# Altium schematic sheet Sheet1.SchDoc
size A2
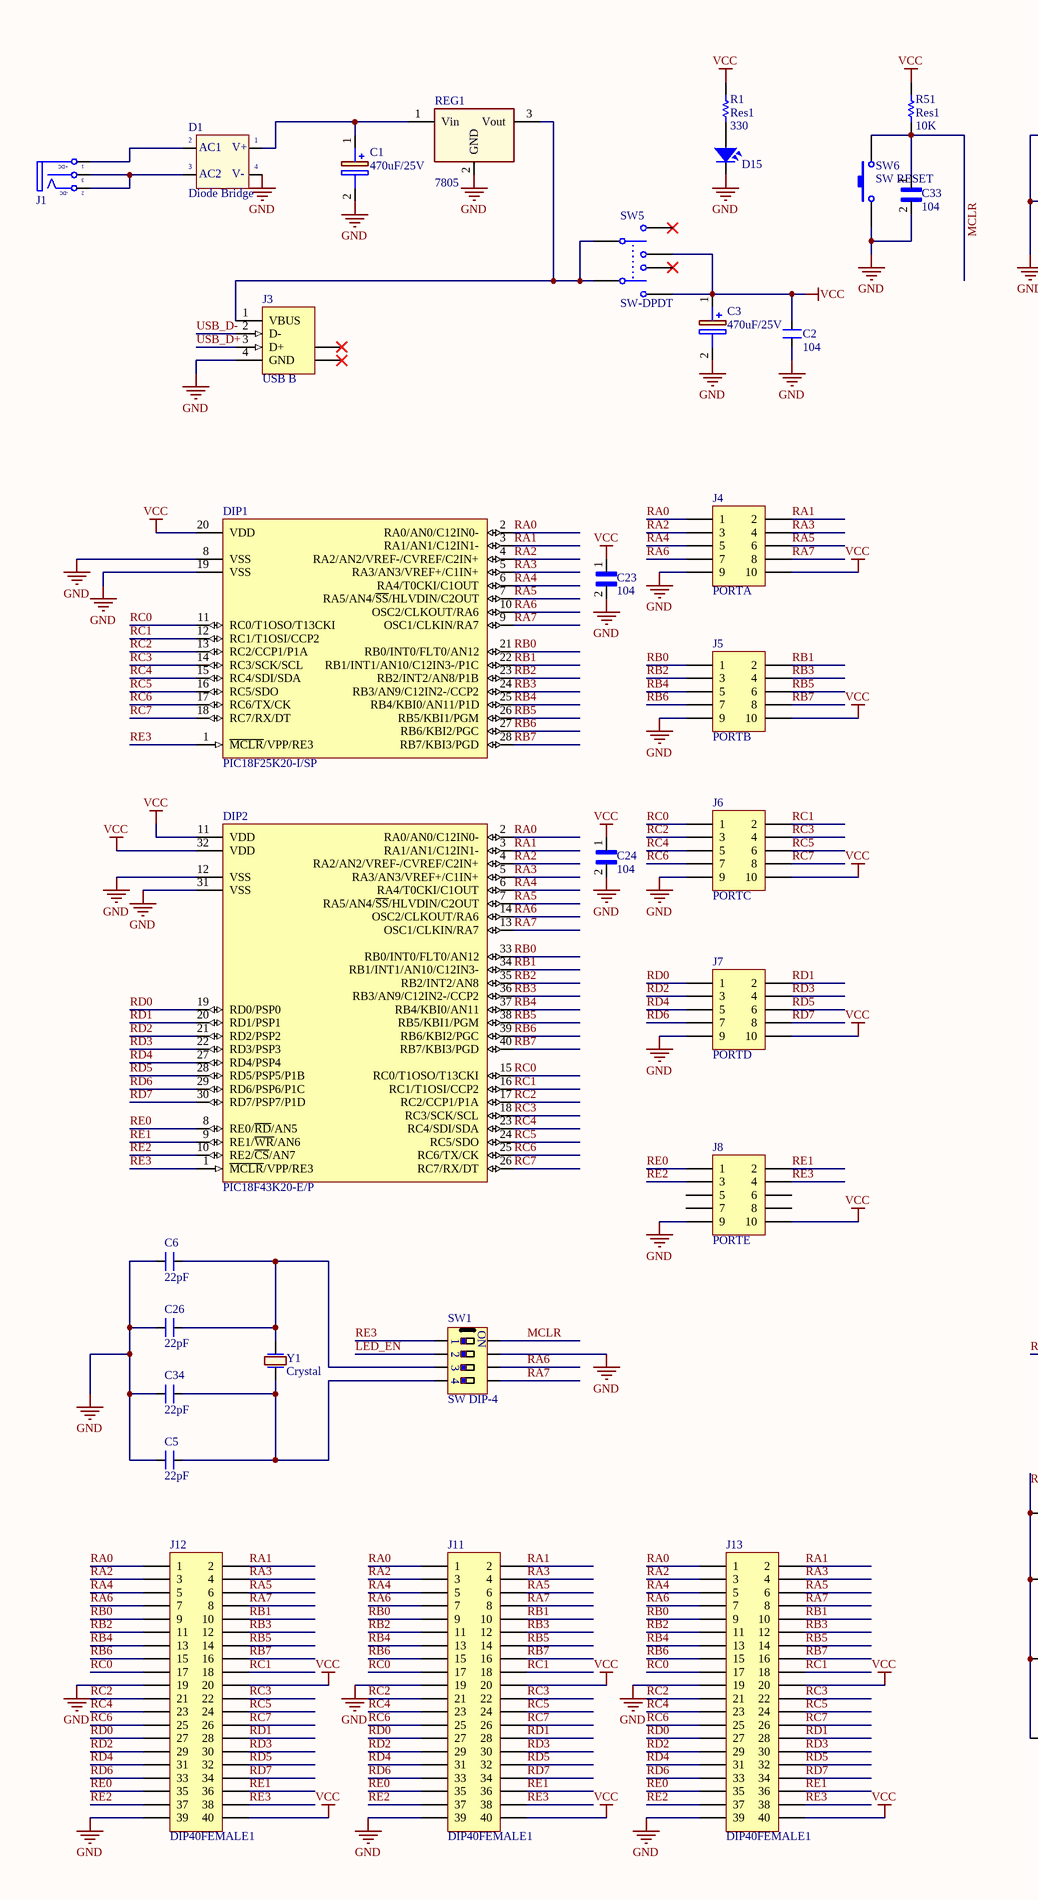
[diagram p0: Sheet1.SchDoc, left]
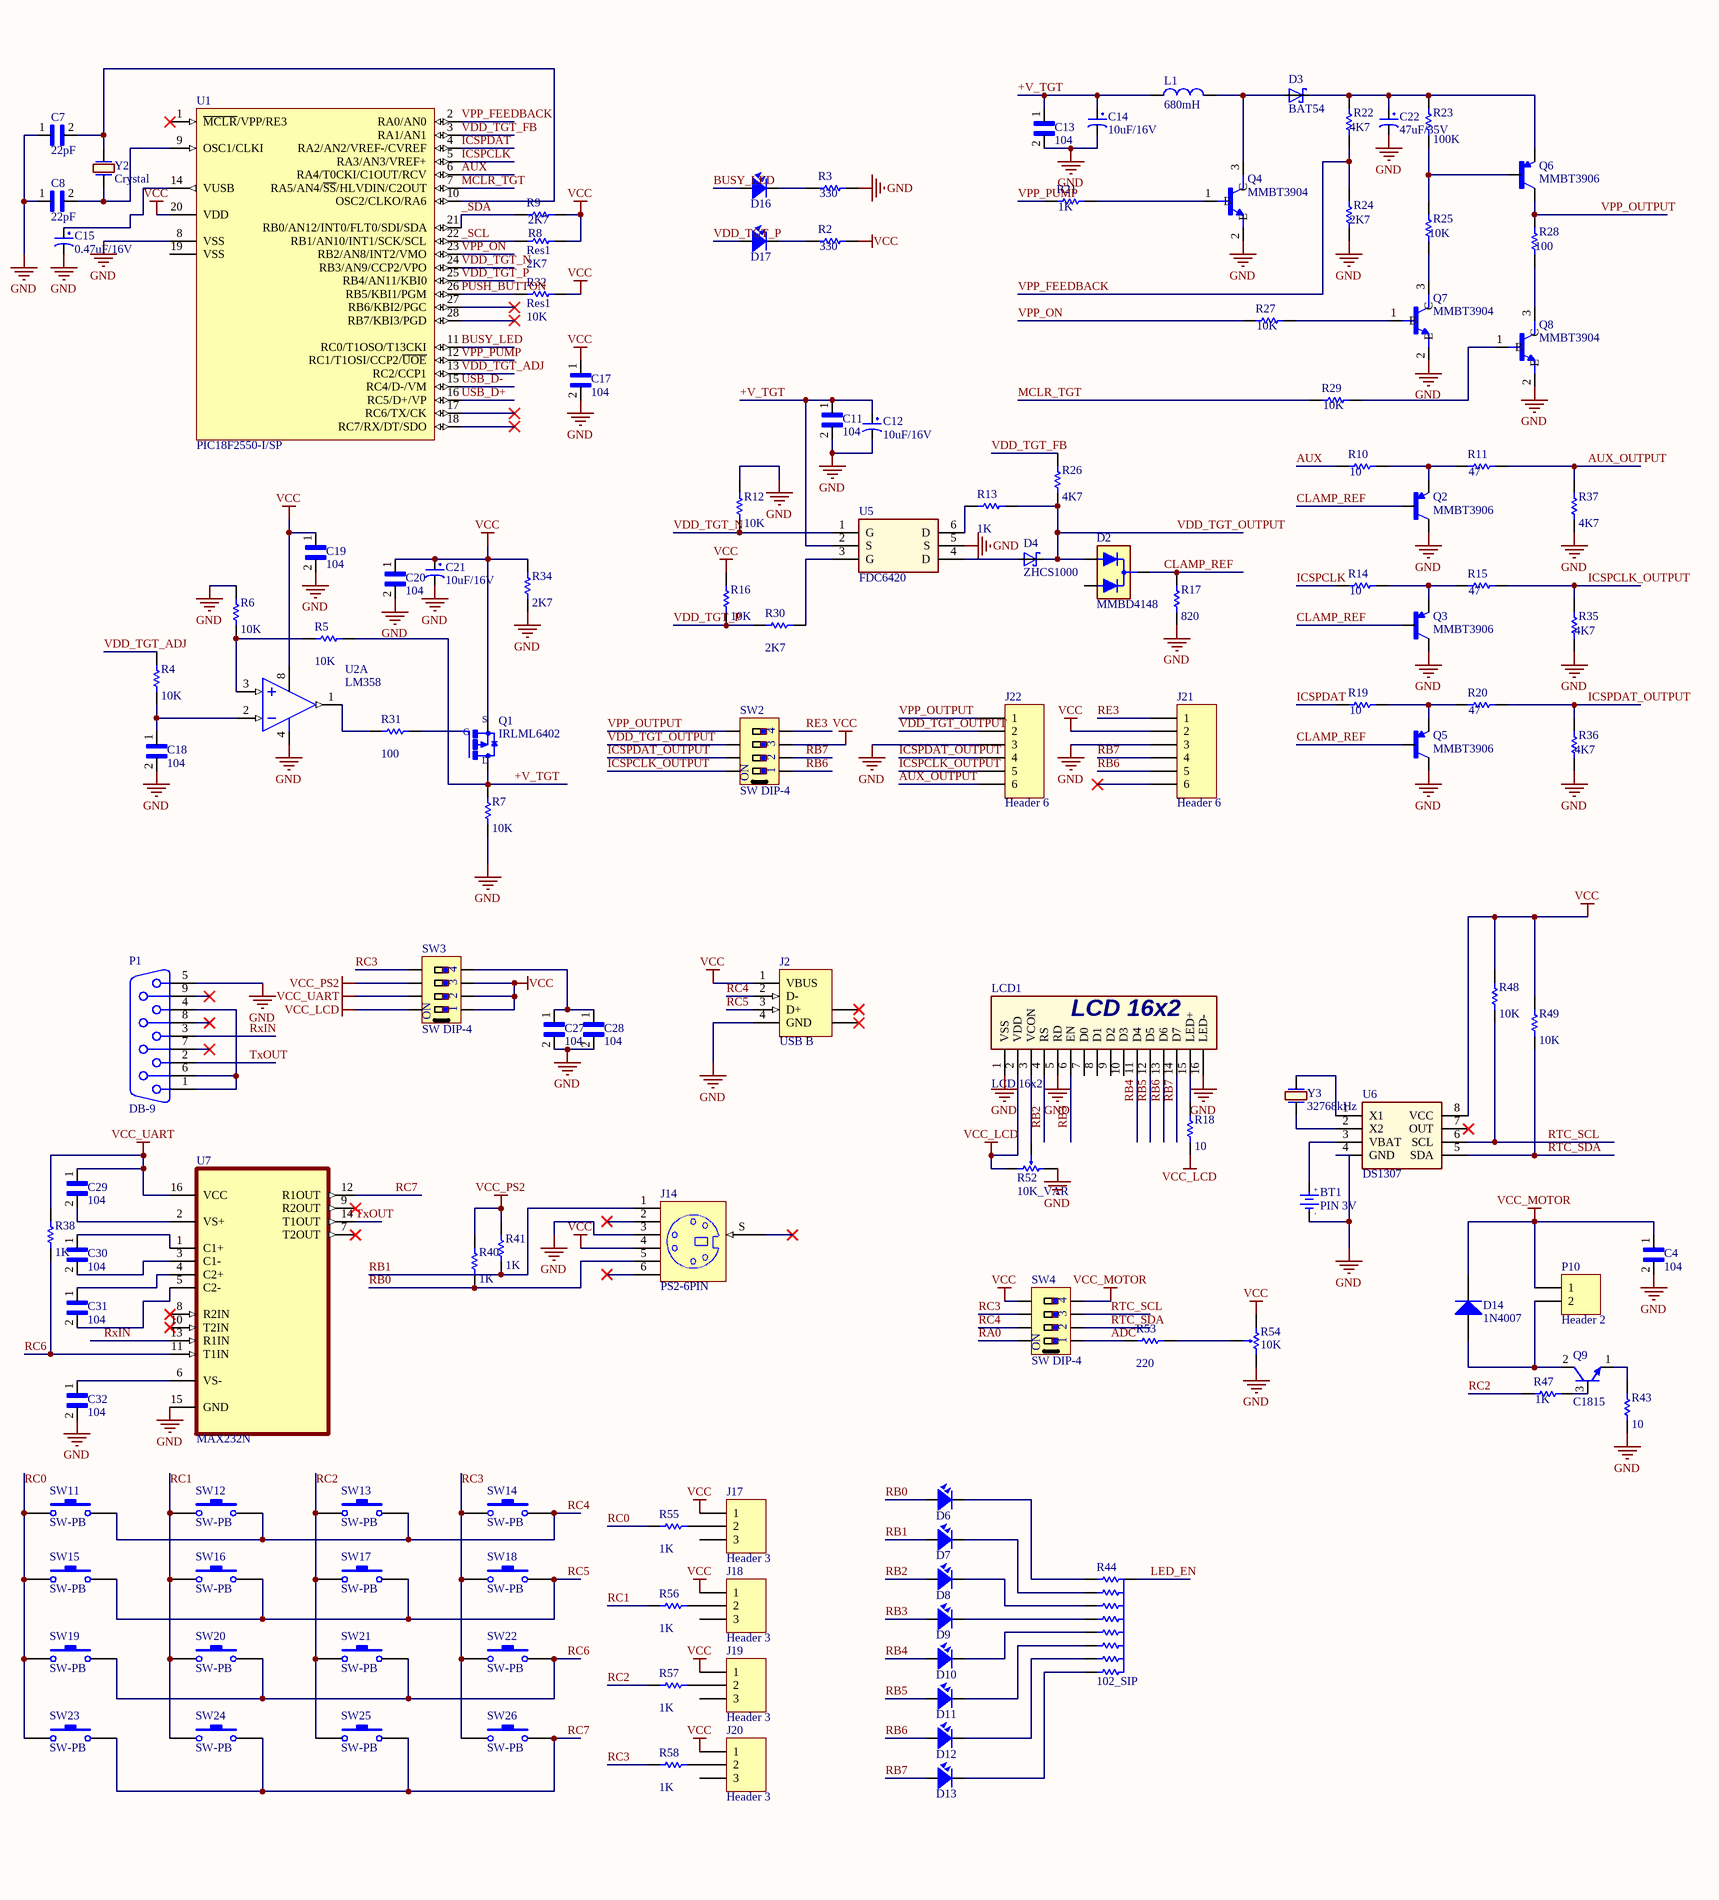
[diagram p1: Sheet1.SchDoc, right]

## Parts
BT1  PIN 3V  [PIN3V]
C1  470uF/25V  [CAPPRD500W60D1000H1400]
C2  104  [CN2]
C3  470uF/25V  [CAPPRD500W60D1000H1400]
C4  104  [CAPC1608X90]
C5  22pF  [CN2]
C6  22pF  [CN2]
C7  22pF  [CAPC1608X90]
C8  22pF  [CAPC1608X90]
C11  104  [CAPC1608X90]
C12  10uF/16V  [CP1/2]
C13  104  [CAPC1608X90]
C14  10uF/16V  [CP1/2]
C15  0.47uF/16V  [CP1/2]
C17  104  [CAPC1608X90]
C18  104  [CAPC1608X90]
C19  104  [CAPC1608X90]
C20  104  [CAPC1608X90]
C21  10uF/16V  [CP1/2]
C22  47uF/35V  [CP1/2]
C23  104  [CAPC1608X90]
C24  104  [CAPC1608X90]
C26  22pF  [CN2]
C27  104  [CAPC1608X90]
C28  104  [CAPC1608X90]
C29  104  [CAPC1608X90]
C30  104  [CAPC1608X90]
C31  104  [CAPC1608X90]
C32  104  [CAPC1608X90]
C33  104  [CAPC1608X90]
C34  22pF  [CN2]
D1  Diode Bridge  [BRIDGE DIODE 2A]
D2  MMBD4148  [SOT23]
D3  BAT54  [SOT23]
D4  ZHCS1000  [SOT-23]
D6  LED  [LED-3]  (value not drawn)
D7  LED  [LED-3]  (value not drawn)
D8  LED  [LED-3]  (value not drawn)
D9  LED  [LED-3]  (value not drawn)
D10  LED  [LED-3]  (value not drawn)
D11  LED  [LED-3]  (value not drawn)
D12  LED  [LED-3]  (value not drawn)
D13  LED  [LED-3]  (value not drawn)
D14  1N4007  [DO-41]
D15  LED  [LED-3]  (value not drawn)
D16  LED  [LED-3]  (value not drawn)
D17  LED  [LED-3]  (value not drawn)
DIP1  PIC18F25K20-I/SP  [SPDIP300-SP28]
DIP2  PIC18F43K20-E/P  [PDIP600-P40]
J1  CON DC PWR  [CON PWR 5MM]  (value not drawn)
J2  USB B  [CON USB B]
J3  USB B  [CON USB B]
J4  PORTA  [HDR2X5]
J5  PORTB  [HDR2X5]
J6  PORTC  [HDR2X5]
J7  PORTD  [HDR2X5]
J8  PORTE  [HDR2X5]
J11  DIP40FEMALE1  [HDR2X20]
J12  DIP40FEMALE1  [HDR2X20]
J13  DIP40FEMALE1  [HDR2X20]
J14  PS2-6PIN  [PS2-6PIN]
J17  Header 3  [HDR1X3]
J18  Header 3  [HDR1X3]
J19  Header 3  [HDR1X3]
J20  Header 3  [HDR1X3]
J21  Header 6  [HDR1X6]
J22  Header 6  [HDR1X6]
L1  680mH  [L/0.4]
LCD1  LCD 16x2  [LCD 16x2]
P1  DB-9  [CON DB9 FEMALE]
P10  Header 2  [HDR1X2]
Q1  IRLML6402  [SOT23]
Q2  MMBT3906  [SOT23-3]
Q3  MMBT3906  [SOT23-3]
Q4  MMBT3904  [SOT95P240X120-3N]
Q5  MMBT3906  [SOT23-3]
Q6  MMBT3906  [SOT23-3]
Q7  MMBT3904  [SOT95P240X120-3N]
Q8  MMBT3904  [SOT95P240X120-3N]
Q9  C1815  [TO-92]
R1  Res1  value 330  [AXIAL-0.3]
R2  value 330  [AXIAL-0.3]
R3  value 330  [AXIAL-0.3]
R4  value 10K  [AXIAL-0.3]
R5  value 10K  [AXIAL-0.3]
R6  value 10K  [AXIAL-0.3]
R7  value 10K  [AXIAL-0.3]
R8  Res1  value 2K7  [AXIAL-0.3]
R9  value 2K7  [AXIAL-0.3]
R10  value 10  [AXIAL-0.3]
R11  value 47  [AXIAL-0.3]
R12  value 10K  [AXIAL-0.3]
R13  value 1K  [AXIAL-0.3]
R14  value 10  [AXIAL-0.3]
R15  value 47  [AXIAL-0.3]
R16  value 10K  [AXIAL-0.3]
R17  value 820  [AXIAL-0.3]
R18  value 10  [AXIAL-0.3]
R19  value 10  [AXIAL-0.3]
R20  value 47  [AXIAL-0.3]
R21  value 1K  [AXIAL-0.3]
R22  value 4K7  [AXIAL-0.3]
R23  value 100K  [AXIAL-0.3]
R24  value 2K7  [AXIAL-0.3]
R25  value 10K  [AXIAL-0.3]
R26  value 4K7  [AXIAL-0.3]
R27  value 10K  [AXIAL-0.3]
R28  value 100  [AXIAL-0.3]
R29  value 10K  [AXIAL-0.3]
R30  value 2K7  [AXIAL-0.3]
R31  value 100  [AXIAL-0.3]
R32  Res1  value 10K  [AXIAL-0.3]
R34  value 2K7  [AXIAL-0.3]
R35  value 4K7  [AXIAL-0.3]
R36  value 4K7  [AXIAL-0.3]
R37  value 4K7  [AXIAL-0.3]
R38  value 1K  [AXIAL-0.3]
R40  value 1K  [AXIAL-0.3]
R41  value 1K  [AXIAL-0.3]
R43  value 10  [AXIAL-0.3]
R44  102_SIP  [R SIP9]
R47  value 1K  [AXIAL-0.3]
R48  value 10K  [AXIAL-0.3]
R49  value 10K  [AXIAL-0.3]
R51  Res1  value 10K  [AXIAL-0.3]
R52  10K_VAR  [R VAR D]
R53  value 220  [AXIAL-0.3]
R54  10K  [R VAR B]
R55  value 1K  [AXIAL-0.3]
R56  value 1K  [AXIAL-0.3]
R57  value 1K  [AXIAL-0.3]
R58  value 1K  [AXIAL-0.3]
REG1  7805  [TO-220]
SW1  SW DIP-4  [SW/DIP4]
SW2  SW DIP-4  [SW/DIP4]
SW3  SW DIP-4  [SW/DIP4]
SW4  SW DIP-4  [SW/DIP4]
SW5  SW-DPDT  [DPDT-6]
SW6  SW RESET  [SPST-2]
SW11  SW-PB  [SPST-2]
SW12  SW-PB  [SPST-2]
SW13  SW-PB  [SPST-2]
SW14  SW-PB  [SPST-2]
SW15  SW-PB  [SPST-2]
SW16  SW-PB  [SPST-2]
SW17  SW-PB  [SPST-2]
SW18  SW-PB  [SPST-2]
SW19  SW-PB  [SPST-2]
SW20  SW-PB  [SPST-2]
SW21  SW-PB  [SPST-2]
SW22  SW-PB  [SPST-2]
SW23  SW-PB  [SPST-2]
SW24  SW-PB  [SPST-2]
SW25  SW-PB  [SPST-2]
SW26  SW-PB  [SPST-2]
U1  PIC18F2550-I/SP  [SPDIP300-SP28]
U2  LM358  [DIP8/W0.3]  (part A of 2)
U5  FDC6420  [SOT-6]
U6  DS1307  [DIP 8]
U7  MAX232N  [DIP254P762X508-16]
Y1  Crystal  [Crystal HC49S DIP]
Y2  Crystal  [Crystal HC49S DIP]
Y3  32768kHz  [Crystal DIP-2]

## Nets
GND: BT1.2(GND) C1.2(-) C2.2 C3.2(-) C4.2 C5.1 C6.1 C7.1 C8.1 C11.2 C12.2 C13.2 C14.2 C15.2 C17.2 C18.2 C19.2 C20.2 C21.2 C22.2 C23.2 C24.2 C26.1 C27.2 C28.2 C32.2 C33.2 C34.1 D1.4(-V_OUT) D15.2 DIP1.8(VSS) DIP1.19(VSS) DIP2.12(VSS) DIP2.31(VSS) J2.4(GND) J3.4(GND) J4.9 J5.9 J6.9 J7.9 J8.9 J11.19 J11.39 J12.19 J12.39 J13.19 J13.39 J14.3 J21.3 J22.3 LCD1.1(VSS) LCD1.5(RD) LCD1.16(LED-) P1.5 Q2.3(C) Q3.3(C) Q4.2(E) Q5.3(C) Q7.2(E) Q8.2(E) R3.2 R6.2 R7.1 R12.2 R17.1 R24.1 R34.1 R35.1 R36.1 R37.1 R43.1 R52.3 R54.1 REG1.2(GND) SW1.7 SW6.1 U1.8(VSS) U2.4(-V) U5.5(S) U6.4(GND) U7.15(GND)
VCC: C2.1 C3.1(+) C17.1 C19.1 C20.1 C21.1 C23.1 C24.1 DIP1.20(VDD) DIP2.11(VDD) DIP2.32(VDD) J2.1(VBUS) J4.10 J5.10 J6.10 J7.10 J8.10 J11.20 J11.40 J12.20 J12.40 J13.20 J13.40 J14.4 J17.1 J18.1 J19.1 J20.1 J21.2 Q1.2(S) R1.2 R2.2 R8.2 R9.2 R16.2 R32.2 R34.2 R48.2 R49.2 R51.2 R54.3 SW2.3 SW3.1 SW3.2 SW3.3 SW4.5 SW5.3 SW5.6 U1.20(VDD) U2.8(+V) U6.8(VCC)
VCC_LCD: LCD1.2(VDD) R18.1 R52.1 SW3.8
VCC_MOTOR: C4.1 D14.2(K) P10.1 SW4.4
VCC_PS2: R40.2 R41.2 SW3.6
VCC_UART: C29.1 R38.2 SW3.7 U7.16(VCC)
+V_TGT: C11.1 C12.1 C13.1 C14.1 L1.1 Q1.3(D) R5.2 R7.2 U5.2(S)
_SCL: R8.1 U1.22(RB1/AN10/INT1/SCK/SCL)
_SDA: R9.1 U1.21(RB0/AN12/INT0/FLT0/SDI/SDA)
ADC: R53.1 SW4.1
AUX: R10.1 U1.6(RA4/T0CKI/C1OUT/RCV)
AUX_OUTPUT: J22.6 R11.2 R37.2
BUSY_LED: D16.1 U1.11(RC0/T1OSO/T13CKI)
CLAMP_REF: D2.3(C) Q2.1(B) Q3.1(B) Q5.1(B) R17.2
ICSPCLK: R14.1 U1.5(RA3/AN3/VREF+)
ICSPCLK_OUTPUT: J22.5 R15.2 R35.2 SW2.8
ICSPDAT: R19.1 U1.4(RA2/AN2/VREF-/CVREF)
ICSPDAT_OUTPUT: J22.4 R20.2 R36.2 SW2.7
LED_EN: R44.1 SW1.2
MCLR: C33.1 R51.1 SW1.8 SW6.2
MCLR_TGT: R29.1 U1.7(RA5/AN4/~{SS}/HLVDIN/C2OUT)
PUSH_BUTTON: R32.1 U1.26(RB5/KBI1/PGM)
RA0: DIP1.2(RA0/AN0/C12IN0-) DIP2.2(RA0/AN0/C12IN0-) J4.1 J11.1 J12.1 J13.1 SW4.8
RA1: DIP1.3(RA1/AN1/C12IN1-) DIP2.3(RA1/AN1/C12IN1-) J4.2 J11.2 J12.2 J13.2
RA2: DIP1.4(RA2/AN2/VREF-/CVREF/C2IN+) DIP2.4(RA2/AN2/VREF-/CVREF/C2IN+) J4.3 J11.3 J12.3 J13.3
RA3: DIP1.5(RA3/AN3/VREF+/C1IN+) DIP2.5(RA3/AN3/VREF+/C1IN+) J4.4 J11.4 J12.4 J13.4
RA4: DIP1.6(RA4/T0CKI/C1OUT) DIP2.6(RA4/T0CKI/C1OUT) J4.5 J11.5 J12.5 J13.5
RA5: DIP1.7(RA5/AN4/~{SS}/HLVDIN/C2OUT) DIP2.7(RA5/AN4/~{SS}/HLVDIN/C2OUT) J4.6 J11.6 J12.6 J13.6
RA6: DIP1.10(OSC2/CLKOUT/RA6) DIP2.14(OSC2/CLKOUT/RA6) J4.7 J11.7 J12.7 J13.7 SW1.6
RA7: DIP1.9(OSC1/CLKIN/RA7) DIP2.13(OSC1/CLKIN/RA7) J4.8 J11.8 J12.8 J13.8 SW1.5
RB0: D6.1 DIP1.21(RB0/INT0/FLT0/AN12) DIP2.33(RB0/INT0/FLT0/AN12) J5.1 J11.9 J12.9 J13.9 J14.5 R40.1
RB1: D7.1 DIP1.22(RB1/INT1/AN10/C12IN3-/P1C) DIP2.34(RB1/INT1/AN10/C12IN3-) J5.2 J11.10 J12.10 J13.10 J14.1 R41.1
RB2: D8.1 DIP1.23(RB2/INT2/AN8/P1B) DIP2.35(RB2/INT2/AN8) J5.3 J11.11 J12.11 J13.11 LCD1.4(RS)
RB3: D9.1 DIP1.24(RB3/AN9/C12IN2-/CCP2) DIP2.36(RB3/AN9/C12IN2-/CCP2) J5.4 J11.12 J12.12 J13.12 LCD1.6(EN)
RB4: D10.1 DIP1.25(RB4/KBI0/AN11/P1D) DIP2.37(RB4/KBI0/AN11) J5.5 J11.13 J12.13 J13.13 LCD1.11(D4)
RB5: D11.1 DIP1.26(RB5/KBI1/PGM) DIP2.38(RB5/KBI1/PGM) J5.6 J11.14 J12.14 J13.14 LCD1.12(D5)
RB6: D12.1 DIP1.27(RB6/KBI2/PGC) DIP2.39(RB6/KBI2/PGC) J5.7 J11.15 J12.15 J13.15 J21.5 LCD1.13(D6) SW2.1
RB7: D13.1 DIP1.28(RB7/KBI3/PGD) DIP2.40(RB7/KBI3/PGD) J5.8 J11.16 J12.16 J13.16 J21.4 LCD1.14(D7) SW2.2
RC0: DIP1.11(RC0/T1OSO/T13CKI) DIP2.15(RC0/T1OSO/T13CKI) J6.1 J11.17 J12.17 J13.17 R55.1 SW11.1 SW15.1 SW19.1 SW23.1
RC1: DIP1.12(RC1/T1OSI/CCP2) DIP2.16(RC1/T1OSI/CCP2) J6.2 J11.18 J12.18 J13.18 R56.1 SW12.1 SW16.1 SW20.1 SW24.1
RC2: DIP1.13(RC2/CCP1/P1A) DIP2.17(RC2/CCP1/P1A) J6.3 J11.21 J12.21 J13.21 R47.1 R57.1 SW13.1 SW17.1 SW21.1 SW25.1
RC3: DIP1.14(RC3/SCK/SCL) DIP2.18(RC3/SCK/SCL) J6.4 J11.22 J12.22 J13.22 R58.1 SW3.5 SW4.6 SW14.1 SW18.1 SW22.1 SW26.1
RC4: DIP1.15(RC4/SDI/SDA) DIP2.23(RC4/SDI/SDA) J2.2(D-) J6.5 J11.23 J12.23 J13.23 SW4.7 SW11.2 SW12.2 SW13.2 SW14.2
RC5: DIP1.16(RC5/SDO) DIP2.24(RC5/SDO) J2.3(D+) J6.6 J11.24 J12.24 J13.24 SW15.2 SW16.2 SW17.2 SW18.2
RC6: DIP1.17(RC6/TX/CK) DIP2.25(RC6/TX/CK) J6.7 J11.25 J12.25 J13.25 R38.1 SW19.2 SW20.2 SW21.2 SW22.2 U7.11(T1IN)
RC7: DIP1.18(RC7/RX/DT) DIP2.26(RC7/RX/DT) J6.8 J11.26 J12.26 J13.26 SW23.2 SW24.2 SW25.2 SW26.2 U7.12(R1OUT)
RD0: DIP2.19(RD0/PSP0) J7.1 J11.27 J12.27 J13.27
RD1: DIP2.20(RD1/PSP1) J7.2 J11.28 J12.28 J13.28
RD2: DIP2.21(RD2/PSP2) J7.3 J11.29 J12.29 J13.29
RD3: DIP2.22(RD3/PSP3) J7.4 J11.30 J12.30 J13.30
RD4: DIP2.27(RD4/PSP4) J7.5 J11.31 J12.31 J13.31
RD5: DIP2.28(RD5/PSP5/P1B) J7.6 J11.32 J12.32 J13.32
RD6: DIP2.29(RD6/PSP6/P1C) J7.7 J11.33 J12.33 J13.33
RD7: DIP2.30(RD7/PSP7/P1D) J7.8 J11.34 J12.34 J13.34
RE0: DIP2.8(RE0/~{RD}/AN5) J8.1 J11.35 J12.35 J13.35
RE1: DIP2.9(RE1/~{WR}/AN6) J8.2 J11.36 J12.36 J13.36
RE2: DIP2.10(RE2/~{CS}/AN7) J8.3 J11.37 J12.37 J13.37
RE3: DIP1.1(~{MCLR}/VPP/RE3) DIP2.1(~{MCLR}/VPP/RE3) J8.4 J11.38 J12.38 J13.38 J21.1 SW1.1 SW2.4
RTC_SCL: R48.1 SW4.3 U6.6(SCL)
RTC_SDA: R49.1 SW4.2 U6.5(SDA)
RxIN: P1.3 U7.13(R1IN)
TxOUT: P1.2 U7.14(T1OUT)
USB_D+: J3.3(D+) U1.16(RC5/D+/VP)
USB_D-: J3.2(D-) U1.15(RC4/D-/VM)
VDD_TGT_ADJ: R4.2 U1.13(RC2/CCP1)
VDD_TGT_FB: R26.2 U1.3(RA1/AN1)
VDD_TGT_N: R12.1 U1.24(RB3/AN9/CCP2/VPO) U5.1(G)
VDD_TGT_OUTPUT: D2.1(A1) D4.1(K) J22.2 R13.2 R26.1 SW2.6
VDD_TGT_P: D17.1 R16.1 R30.1 U1.25(RB4/AN11/KBI0)
VPP_FEEDBACK: R22.1 R24.2 U1.2(RA0/AN0)
VPP_ON: R27.1 U1.23(RB2/AN8/INT2/VMO)
VPP_OUTPUT: J22.1 Q6.3(C) R28.2 SW2.5
VPP_PUMP: R21.1 U1.12(RC1/T1OSI/CCP2/~{UOE})
NetBT1_1: BT1.1(+3V) U6.3(VBAT)
NetC1_1: C1.1(+) D1.1(+V_OUT) REG1.1(Vin)
NetC5_2: C5.2 C34.2 SW1.4 Y1.1
NetC6_2: C6.2 C26.2 SW1.3 Y1.2
NetC7_2: C7.2 U1.10(OSC2/CLKO/RA6) Y2.1
NetC8_2: C8.2 U1.9(OSC1/CLKI) Y2.2
NetC15_1: C15.1 U1.14(VUSB)
NetC18_1: C18.1 R4.1 U2.2(IN-)
NetC22_1: C22.1 D3.3(K) Q6.2(E) R22.2 R23.2
NetC27_1: C27.1 C28.1 SW3.4
NetC29_2: C29.2 U7.2(VS+)
NetC30_1: C30.1 U7.1(C1+)
NetC30_2: C30.2 U7.3(C1-)
NetC31_1: C31.1 U7.4(C2+)
NetC31_2: C31.2 U7.5(C2-)
NetC32_1: C32.1 U7.6(VS-)
NetD1_2: D1.2(AC1) J1.1(T)
NetD1_3: D1.3(AC2) J1.2(TN) J1.3(S)
NetD3_1: D3.1(A) L1.2 Q4.3(C)
NetD4_3: D4.3(A) U5.4(D)
NetD6_2: D6.2 R44.2
NetD7_2: D7.2 R44.3
NetD8_2: D8.2 R44.4
NetD9_2: D9.2 R44.5
NetD10_2: D10.2 R44.6
NetD11_2: D11.2 R44.7
NetD12_2: D12.2 R44.8
NetD13_2: D13.2 R44.9
NetD14_1: D14.1(A) P10.2 Q9.2(C)
NetD15_1: D15.1 R1.1
NetD16_2: D16.2 R3.1
NetD17_2: D17.2 R2.1
NetJ3_1: J3.1(VBUS) REG1.3(Vout) SW5.1 SW5.4
NetJ17_2: J17.2 R55.2
NetJ18_2: J18.2 R56.2
NetJ19_2: J19.2 R57.2
NetJ20_2: J20.2 R58.2
NetLCD1_3: LCD1.3(VCON) R52.2
NetLCD1_15: LCD1.15(LED+) R18.2
NetP1_1: P1.1 P1.4 P1.6
NetQ1_1: Q1.1(G) R31.2
NetQ2_2: Q2.2(E) R10.2 R11.1
NetQ3_2: Q3.2(E) R14.2 R15.1
NetQ4_1: Q4.1(B) R21.2
NetQ5_2: Q5.2(E) R19.2 R20.1
NetQ6_1: Q6.1(B) R23.1 R25.2
NetQ7_1: Q7.1(B) R27.2
NetQ7_3: Q7.3(C) R25.1
NetQ8_1: Q8.1(B) R29.2
NetQ8_3: Q8.3(C) R28.1
NetQ9_1: Q9.1(E) R43.2
NetQ9_3: Q9.3(B) R47.2
NetR5_1: R5.1 R6.1 U2.3(IN+)
NetR13_1: R13.1 U5.6(D)
NetR30_2: R30.2 U5.3(G)
NetR31_1: R31.1 U2.1(OUT)
NetR53_2: R53.2 R54.2
NetU6_1: U6.1(X1) Y3.2
NetU6_2: U6.2(X2) Y3.1

Not connected (* = marked no-connect by the designer): D2 2(A2); J2 5(SHLD)* 6(SHLD)*; J3 5(SHLD)* 6(SHLD)*; J8 5 6 7 8; J14 2* 6* S*; J17 3; J18 3; J19 3; J20 3; J21 6*; LCD1 7(D0) 8(D1) 9(D2) 10(D3); P1 7* 8* 9*; SW5 2* 5*; U1 1(~{MCLR}/VPP/RE3)* 17(RC6/TX/CK)* 18(RC7/RX/DT/SDO)* 19(VSS) 27(RB6/KBI2/PGC)* 28(RB7/KBI3/PGD)*; U6 7(OUT)*; U7 7(T2OUT)* 8(R2IN)* 9(R2OUT)* 10(T2IN)*

## Notes on the sheet
- Title
- Size:
- Date:
- File:
- A2
- Number:
- Time:
- Revision:
- Sheet
- of
- (in symbol CON DC PWR) +DC; -DC
- (in symbol Diode Bridge) V+; V-
- (in symbol PIN 3V) +; -
- (in symbol SW DIP-4) ON

## Library data of the parts
BT1 = PIN 3V: Battery 3VDC; Value: PIN 3V
C1 C3 = ESL477M025AH9AA: Capacitor Polarised; Manufacturer_Name: Kemet; Datasheet Link: https://componentsearchengine.com/Datasheets/1/ESL477M025AH9AA.pdf; Height: 14mm; Manufacturer_Part_Number: ESL477M025AH9AA; Mouser Part Number: 80-ESL477M025AH9AA; Mouser Price/Stock: https://www.mouser.com/Search/Refine.aspx?Keyword=80-ESL477M025AH9AA
C2 C5 C6 C26 C34 = CN2: Cap np 104 => 105pF; Value: 0.1uF
C4 C7 C8 C11 C13 C17-C20 C23 C24 C27-C33 = CC0603KRX7R9BB104: 0.1ÂµF Â±10% 50V Ceramic Capacitor X7R 0603 _1608 Metric_; MF: Yageo; Digi-Key_Purchase_URL: https://www.digikey.com/product-detail/en/yageo/CC0603KRX7R9BB104/311-1344-1-ND/2103128?utm_source=snapeda&utm_medium=aggregator&utm_campaign=symbol; Digi-Key_Part_Number: 311-1344-1-ND; Package: 0603 Yageo; MP: CC0603KRX7R9BB104; Value: *; SnapEDA_Link: https://www.snapeda.com/parts/CC0603KRX7R9BB104/Yageo/view-part/78680/?ref=snap
C12 C14 C15 C21 C22 = CP1: Cap P  0,1uF < 22uF , 16 - 50V; Value: 10uF/50V; Description 1: 10 => 220uF/6,3V/10V - 10uF => 100uF/16V; Description 2: 0,1uF => 33uF/50V - 10uF => 22uF/63V; Description 3: 0,47uF => 10uF/100V
D1 = Diode Bridge: Convert AC to DC voltage, 4 pin; Value: Cau 1A
D2 = MMBD4148: Diode Array 1 Pair Series Connection Standard 100V 200mA Surface Mount TO-236-3, SC-59, SOT-23-3; MF: ON Semiconductor; Value: *; SnapEDA_Link: https://www.snapeda.com/parts/MMBD4148/ON%20Semiconductor/view-part/2781890/?ref=snap; Availability: Unavailable; Price: None; Package: SOT-23-3 Nexperia; MP: MMBD4148
D3 = BAT54: Diode Schottky 30V 200mA Surface Mount SOT-23-3 _TO-236_; MF: ON Semiconductor; MP: BAT54; Package: SOT-23-3 ON Semiconductor; Price: None; Availability: Unavailable; Value: *; SnapEDA_Link: https://www.snapeda.com/parts/BAT54/ON%20Semiconductor/view-part/1356687/?ref=snap
D4 = ZHCS1000: Diode Schottky 40V 1A _DC_ Surface Mount SOT-23-3; MF: Diodes Inc.; Package: SOT-23 Diodes Inc.; MP: ZHCS1000; Availability: Unavailable; Price: None; Value: *; SnapEDA_Link: https://www.snapeda.com/parts/ZHCS1000/Diodes%20Inc./view-part/53280/?ref=snap
D6-D13 D15-D17 = LED: LED Single colour Green and Red; Value: LED 3 ly Single Colour
D14 = Diode 1N4007: 1 Amp General Purpose Rectifier; Published: 8-Jun-2000; LatestRevisionDate: 17-Jul-2002; LatestRevisionNote: Re-released for DXP Platform.; DatasheetVersion: 1998; PackageVersion: Aug-1999; PackageReference: DO-41; Publisher: Altium Limited; PackageDescription: Diode, Axial; Body 5.2 x 2.7 mm (LxDia. max), Lead Dia. 0.86 mm (max); Code_JEDEC: DO-204-AL; ComponentLink1Description: Manufacturer Link; ComponentLink1URL: http://www.fairchildsemi.com/; ComponentLink2Description: Datasheet; ComponentLink2URL: http://www.fairchildsemi.com/ds/1N%2F1N4001.pdf
DIP1 = PIC18F25K20-I/SP: Flash Microcontroller with 10-Bit A/D and nanoWatt Technology, 32K Flash, 28-Pin SPDIP, Industrial Temperature Range; Published: 29-Jan-2009; LatestRevisionDate: 02-Dec-2009; LatestRevisionNote: Updated to datasheet revision F, Sep-2009; DatasheetVersion: revF, Sep-2009; PackageVersion: revBB, Aug-2009; PackageReference: SPDIP300-SP28; Publisher: Altium Limited; PackageDescription: 28-Lead Skinny Plastic Dual In-Line (SP) - 300 mil Body [SPDIP]; Supplier 1: Digi-Key; Supplier Part Number 1: PIC18F25K20-I/SP-ND; Supplier 2: Farnell; Supplier Part Number 2: 1439578; ComponentLink1Description: Datasheet; ComponentLink1URL: http://ww1.microchip.com/downloads/en/DeviceDoc/41303F.pdf; ComponentLink2Description: Packaging Specification; ComponentLink2URL: http://www.microchip.com/stellent/groups/techpub_sg/documents/packagingspec/en012702.pdf; ComponentLink3Description: Microchip.com Home; ComponentLink3URL: http://www.microchip.com/
DIP2 = PIC18F43K20-E/P: Flash Microcontroller with nanoWatt XLP Technology, 40-pin PDIP, Extended Temperature; Published: 2-Dec-2009; DatasheetVersion: revF, Sep-2009; PackageVersion: revBB, Aug-2009; PackageReference: PDIP600-P40; Publisher: Altium Limited; PackageDescription: 40-Lead Plastic Dual In-Line (P) - 600 mil Body [PDIP]; Supplier 1: Digi-Key; Supplier Part Number 1: PIC18F43K20-E/P-ND; ComponentLink1Description: Datasheet; ComponentLink1URL: http://ww1.microchip.com/downloads/en/DeviceDoc/41303F.pdf; ComponentLink2Description: Packaging Specification; ComponentLink2URL: http://www.microchip.com/stellent/groups/techpub_sg/documents/packagingspec/en012702.pdf; ComponentLink3Description: Microchip.com Home; ComponentLink3URL: http://www.microchip.com/
J1 = CON DC PWR: DC input connector
J2 J3 = CON USB B: USB type B, 4 pins
J4-J8 = Header 5X2: Header, 5-Pin, Dual row; LatestRevisionDate: 17-Jul-2002; LatestRevisionNote: Re-released for DXP Platform.; Publisher: Altium Limited
J11-J13 = Header 20X2: Header, 20-Pin, Dual row; LatestRevisionDate: 17-Jul-2002; LatestRevisionNote: Re-released for DXP Platform.; Publisher: Altium Limited
J14 = PS2-6PIN: 6 Pin Through Hole PS2 Socket (Kycon P/N); Published: 17-Dec-2003; Publisher: Altium Limited; ComponentLink1Description: Manufacturer Link; ComponentLink1URL: http://www.oupiin.com/prodindx.html#Headers
J17-J20 = Header 3: Header, 3-Pin; LatestRevisionDate: 17-Jul-2002; LatestRevisionNote: Re-released for DXP Platform.; Publisher: Altium Limited
J21 J22 = Header 6: Header, 6-Pin; LatestRevisionDate: 17-Jul-2002; LatestRevisionNote: Re-released for DXP Platform.; Publisher: Altium Limited
L1 = L1: Inductor; Value: 150 mH
LCD1 = LCD 16x2: Character LCD 16x2
P1 = CON DB-9: Connector D-Sub 9
P10 = Header 2: Header, 2-Pin; LatestRevisionDate: 17-Jul-2002; LatestRevisionNote: Re-released for DXP Platform.; Publisher: Altium Limited
Q1 = IRLML6402: P-Channel 20V 3.7A _Ta_ 1.3W _Ta_ Surface Mount Micro3â„¢/SOT-23; MF: Infineon Technologies; Package: SC-59 Infineon Technologies; Value: *; Availability: Unavailable; SnapEDA_Link: https://www.snapeda.com/parts/IRLML6402/Infineon%20Technologies/view-part/2522811/?ref=snap; Price: None; MP: IRLML6402
Q2 Q3 Q5 Q6 = MMBT3906: Bipolar _BJT_ Transistor; MF: STMicroelectronics; Price: None; SnapEDA_Link: https://www.snapeda.com/parts/MMBT3906/STMicroelectronics/view-part/2548435/?ref=snap; Package: SOT-23 ON Semiconductor; Availability: Unavailable; MP: MMBT3906; Value: *
Q4 Q7 Q8 = MMBT3904: Bipolar _BJT_ Transistor NPN 40V 200mA 270MHz 350mW Surface Mount SOT-23-3; MF: STMicroelectronics; Price: None; Package: SOT-23-3 Taiwan Semiconductor; Value: *; MP: MMBT3904; Availability: Unavailable; SnapEDA_Link: https://www.snapeda.com/parts/MMBT3904/STMicroelectronics/view-part/2875870/?ref=snap
Q9 = Transistor NPN - C1815: NPN Bipolar Transistor
R1-R32 R34-R38 R40 R41 R43 R47-R49 R51 R53 R55-R58 = Res1: Resistor; Published: 8-Jun-2000; LatestRevisionDate: 17-Jul-2002; LatestRevisionNote: Re-released for DXP Platform.; PackageReference: AXIAL-0.3; Publisher: Altium Limited; PackageDescription: Axial Device, Thru-Hole; 2 Leads; 0.3 in Pin Spacing
R44 = Resistor Sip9: Resistor; Published: 8-Jun-2000; LatestRevisionDate: 17-Jul-2002; LatestRevisionNote: Re-released for DXP Platform.; PackageReference: AXIAL-0.3; Publisher: Altium Limited
R52 R54 = Resistor Variable
REG1 = 78xx/78Mxx: LDO Fixed Voltage regulator
SW5 = SW-DPDT: Double-Pole, Double-Throw Switch; Published: 24-Mar-1999; LatestRevisionDate: 17-Jul-2002; LatestRevisionNote: Re-released for DXP Platform.; PackageReference: DPDT-6; Publisher: Altium Limited; PackageDescription: Switch; 6 Leads
SW6 SW11-SW26 = SW-PB: Switch; Published: 24-Mar-1999; LatestRevisionDate: 17-Jul-2002; LatestRevisionNote: Re-released for DXP Platform.; PackageReference: SPST-2; Publisher: Altium Limited; PackageDescription: Switch; 2 Leads
U1 = PIC18F2550-I/SP: High Performance, Enhanced Flash, USB Microcontroller with nanoWatt Technology, 32K Flash, 28-Pin SPDIP, Industrial Temperature Range; Published: 29-Jan-2009; LatestRevisionDate: 02-Dec-2009; LatestRevisionNote: Updated to datasheet revision E, Aug-2008; DatasheetVersion: revE, Aug-2008; PackageVersion: revBB, Aug-2009; PackageReference: SPDIP300-SP28; Publisher: Altium Limited; PackageDescription: 28-Lead Skinny Plastic Dual In-Line (SP) - 300 mil Body [SPDIP]; Supplier 1: Digi-Key; Supplier Part Number 1: PIC18F2550-I/SP-ND; Supplier 2: Farnell; Supplier Part Number 2: 9321250; Supplier 3: Farnell; Supplier Part Number 3: 1523822; ComponentLink1Description: Datasheet; ComponentLink1URL: http://ww1.microchip.com/downloads/en/DeviceDoc/39632e.pdf; ComponentLink2Description: Packaging Specification; ComponentLink2URL: http://www.microchip.com/stellent/groups/techpub_sg/documents/packagingspec/en012702.pdf; ComponentLink3Description: Microchip.com Home; ComponentLink3URL: http://www.microchip.com/
U2 = LM358: Low-Power Dual Operational Amplifier; Value: LM358
U5 = FDC6420: 20V N & P-Channel PowerTrenchÒ MOSFETs
U7 = MAX232N: 2/2 Transceiver Full RS232 16-PDIP; MF: Texas Instruments; Price: None; Availability: Unavailable; Package: PDIP-16 Maxim Integrated; SnapEDA_Link: https://www.snapeda.com/parts/MAX232N/Texas%20Instruments/view-part/552531/?ref=snap; MP: MAX232N; Value: *
Y3 = Crystal